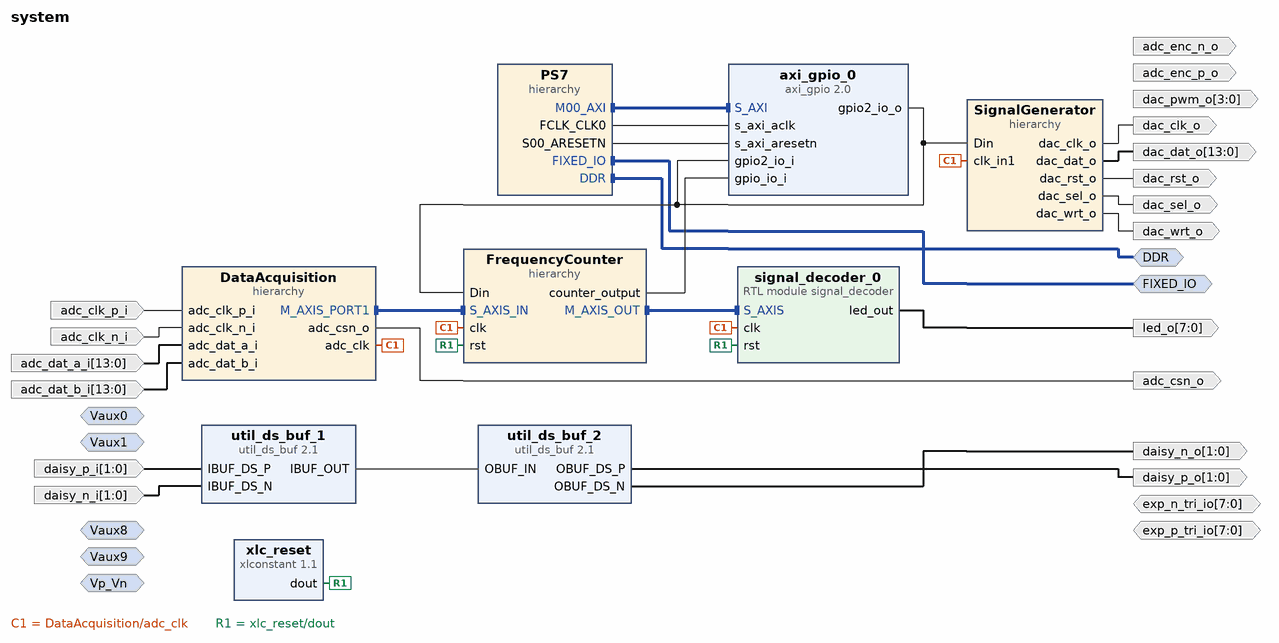
[diagram p0: block diagram of the top level]
# Vivado block design system, xc7z010clg400-1, Vivado 2020.1
create_bd_design system

create_bd_intf_port -mode Slave -vlnv xilinx.com:interface:diff_analog_io_rtl:1.0 Vp_Vn
create_bd_intf_port -mode Slave -vlnv xilinx.com:interface:diff_analog_io_rtl:1.0 Vaux0
create_bd_intf_port -mode Slave -vlnv xilinx.com:interface:diff_analog_io_rtl:1.0 Vaux1
create_bd_intf_port -mode Slave -vlnv xilinx.com:interface:diff_analog_io_rtl:1.0 Vaux9
create_bd_intf_port -mode Slave -vlnv xilinx.com:interface:diff_analog_io_rtl:1.0 Vaux8
create_bd_intf_port -mode Master -vlnv xilinx.com:interface:ddrx_rtl:1.0 DDR
create_bd_intf_port -mode Master -vlnv xilinx.com:display_processing_system7:fixedio_rtl:1.0 FIXED_IO
create_bd_port -dir I -from 13 -to 0 adc_dat_a_i
create_bd_port -dir I -from 13 -to 0 adc_dat_b_i
create_bd_port -dir I adc_clk_p_i
create_bd_port -dir I adc_clk_n_i
create_bd_port -dir O adc_enc_p_o
create_bd_port -dir O adc_enc_n_o
create_bd_port -dir O adc_csn_o
create_bd_port -dir O -from 13 -to 0 dac_dat_o
create_bd_port -dir O dac_clk_o
create_bd_port -dir O dac_rst_o
create_bd_port -dir O dac_sel_o
create_bd_port -dir O dac_wrt_o
create_bd_port -dir O -from 3 -to 0 dac_pwm_o
create_bd_port -dir IO -from 7 -to 0 exp_p_tri_io
create_bd_port -dir IO -from 7 -to 0 exp_n_tri_io
create_bd_port -dir O -from 1 -to 0 daisy_p_o
create_bd_port -dir O -from 1 -to 0 daisy_n_o
create_bd_port -dir I -from 1 -to 0 daisy_p_i
create_bd_port -dir I -from 1 -to 0 daisy_n_i
create_bd_port -dir O -from 7 -to 0 led_o

create_bd_cell -type ip -vlnv xilinx.com:ip:util_ds_buf:2.1 util_ds_buf_1
set_property -dict {CONFIG.C_SIZE 2} [get_bd_cells util_ds_buf_1]
create_bd_cell -type ip -vlnv xilinx.com:ip:util_ds_buf:2.1 util_ds_buf_2
set_property -dict {CONFIG.C_BUF_TYPE OBUFDS CONFIG.C_SIZE 2} [get_bd_cells util_ds_buf_2]
create_bd_cell -type ip -vlnv xilinx.com:ip:axi_gpio:2.0 axi_gpio_0
set_property -dict {CONFIG.C_ALL_INPUTS 1 CONFIG.C_ALL_INPUTS_2 0 CONFIG.C_IS_DUAL 1} [get_bd_cells axi_gpio_0]
create_bd_cell -type ip -vlnv xilinx.com:ip:xlconstant:1.1 xlc_reset
create_bd_cell -type module -reference signal_decoder signal_decoder_0
create_bd_cell -type hier SignalGenerator
create_bd_cell -type hier DataAcquisition
create_bd_cell -type hier FrequencyCounter
create_bd_cell -type hier PS7

# ---- hierarchy /SignalGenerator ----
current_bd_instance /SignalGenerator
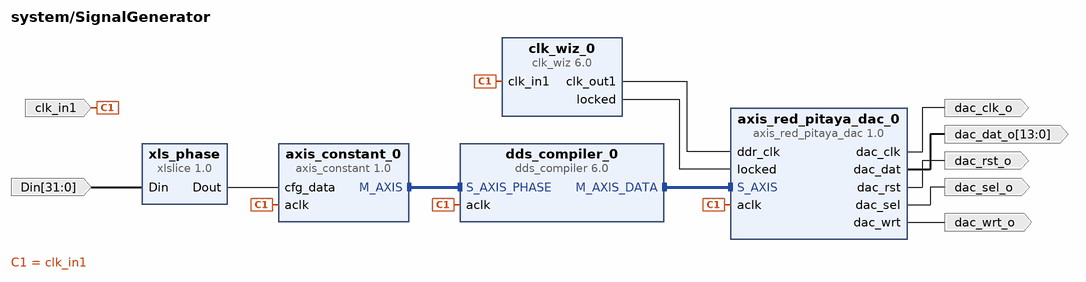
[diagram p1: block diagram inside /SignalGenerator]
create_bd_pin -dir I -type clk clk_in1
create_bd_pin -dir O -type clk dac_clk_o
create_bd_pin -dir O -type rst dac_rst_o
create_bd_pin -dir O dac_sel_o
create_bd_pin -dir O dac_wrt_o
create_bd_pin -dir O -from 13 -to 0 dac_dat_o
create_bd_pin -dir I -from 31 -to 0 Din

create_bd_cell -type ip -vlnv pavel-demin:user:axis_red_pitaya_dac:1.0 axis_red_pitaya_dac_0
create_bd_cell -type ip -vlnv xilinx.com:ip:dds_compiler:6.0 dds_compiler_0
set_property -dict [list \
  CONFIG.Amplitude_Mode Full_Range \
  CONFIG.DATA_Has_TLAST Not_Required \
  CONFIG.DDS_Clock_Rate 125 \
  CONFIG.Frequency_Resolution 0.5 \
  CONFIG.Has_Phase_Out false \
  CONFIG.Latency 8 \
  CONFIG.Latency_Configuration Auto \
  CONFIG.M_DATA_Has_TUSER Not_Required \
  CONFIG.M_PHASE_Has_TUSER Not_Required \
  CONFIG.Noise_Shaping Auto \
  CONFIG.Output_Frequency1 0 \
  CONFIG.Output_Width 14 \
  CONFIG.PINC1 0 \
  CONFIG.Parameter_Entry System_Parameters \
  CONFIG.PartsPresent Phase_Generator_and_SIN_COS_LUT \
  CONFIG.Phase_Increment Streaming \
  CONFIG.Phase_Width 28 \
  CONFIG.Phase_offset None \
  CONFIG.S_PHASE_Has_TUSER Not_Required \
  CONFIG.Spurious_Free_Dynamic_Range 84 \
] [get_bd_cells dds_compiler_0]
create_bd_cell -type ip -vlnv xilinx.com:ip:clk_wiz:6.0 clk_wiz_0
set_property -dict [list \
  CONFIG.CLKIN1_JITTER_PS 80.0 \
  CONFIG.CLKOUT1_JITTER 104.759 \
  CONFIG.CLKOUT1_PHASE_ERROR 96.948 \
  CONFIG.CLKOUT1_REQUESTED_OUT_FREQ 250.000 \
  CONFIG.MMCM_CLKFBOUT_MULT_F 8.000 \
  CONFIG.MMCM_CLKIN1_PERIOD 8.000 \
  CONFIG.MMCM_CLKOUT0_DIVIDE_F 4.000 \
  CONFIG.MMCM_DIVCLK_DIVIDE 1 \
  CONFIG.PRIM_IN_FREQ 125.000 \
  CONFIG.USE_RESET false \
] [get_bd_cells clk_wiz_0]
create_bd_cell -type ip -vlnv pavel-demin:user:axis_constant:1.0 axis_constant_0
create_bd_cell -type ip -vlnv xilinx.com:ip:xlslice:1.0 xls_phase
set_property -dict {CONFIG.DIN_FROM 31 CONFIG.DIN_TO 5} [get_bd_cells xls_phase]

# ---- hierarchy /DataAcquisition ----
current_bd_instance /DataAcquisition
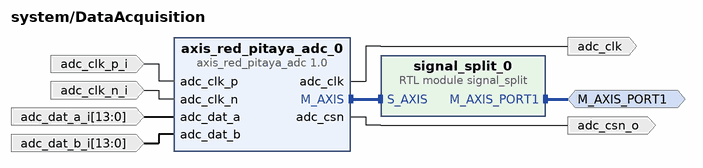
[diagram p2: block diagram inside /DataAcquisition]
create_bd_intf_pin -mode Master -vlnv xilinx.com:interface:axis_rtl:1.0 M_AXIS_PORT1
create_bd_pin -dir O -type clk adc_clk
create_bd_pin -dir O adc_csn_o
create_bd_pin -dir I adc_clk_p_i
create_bd_pin -dir I adc_clk_n_i
create_bd_pin -dir I -from 13 -to 0 adc_dat_a_i
create_bd_pin -dir I -from 13 -to 0 adc_dat_b_i

create_bd_cell -type ip -vlnv pavel-demin:user:axis_red_pitaya_adc:1.0 axis_red_pitaya_adc_0
create_bd_cell -type module -reference signal_split signal_split_0

# ---- hierarchy /FrequencyCounter ----
current_bd_instance /FrequencyCounter
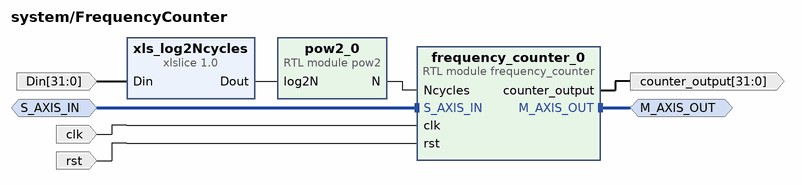
[diagram p3: block diagram inside /FrequencyCounter]
create_bd_intf_pin -mode Master -vlnv xilinx.com:interface:axis_rtl:1.0 M_AXIS_OUT
create_bd_intf_pin -mode Slave -vlnv xilinx.com:interface:axis_rtl:1.0 S_AXIS_IN
create_bd_pin -dir I -from 31 -to 0 Din
create_bd_pin -dir I -type clk clk
create_bd_pin -dir I -type rst rst
create_bd_pin -dir O -from 31 -to 0 counter_output

create_bd_cell -type ip -vlnv xilinx.com:ip:xlslice:1.0 xls_log2Ncycles
set_property -dict {CONFIG.DIN_FROM 4 CONFIG.DIN_TO 0} [get_bd_cells xls_log2Ncycles]
create_bd_cell -type module -reference pow2 pow2_0
create_bd_cell -type module -reference frequency_counter frequency_counter_0

# ---- hierarchy /PS7 ----
current_bd_instance /PS7
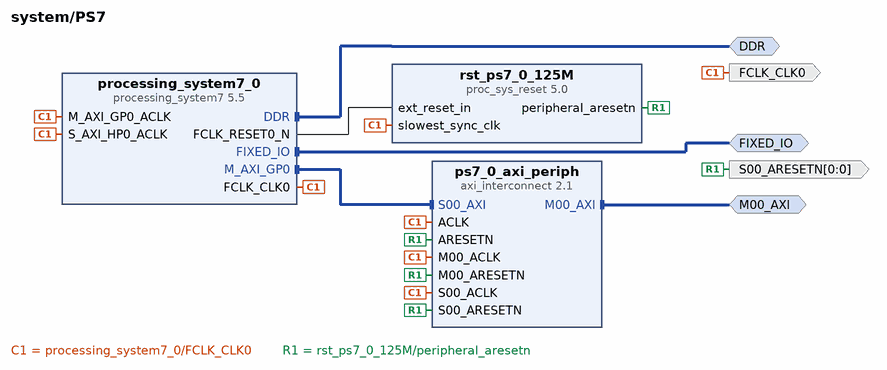
[diagram p4: block diagram inside /PS7]
create_bd_intf_pin -mode Master -vlnv xilinx.com:interface:ddrx_rtl:1.0 DDR
create_bd_intf_pin -mode Master -vlnv xilinx.com:display_processing_system7:fixedio_rtl:1.0 FIXED_IO
create_bd_intf_pin -mode Master -vlnv xilinx.com:interface:aximm_rtl:1.0 M00_AXI
create_bd_pin -dir O -type clk FCLK_CLK0
create_bd_pin -dir O -from 0 -to 0 -type rst S00_ARESETN

create_bd_cell -type ip -vlnv xilinx.com:ip:processing_system7:5.5 processing_system7_0
set_property -dict [list \
  CONFIG.PCW_APU_PERIPHERAL_FREQMHZ 666.666666 \
  CONFIG.PCW_ENET0_ENET0_IO {MIO 16 .. 27} \
  CONFIG.PCW_ENET0_GRP_MDIO_ENABLE 1 \
  CONFIG.PCW_ENET0_GRP_MDIO_IO EMIO \
  CONFIG.PCW_ENET0_PERIPHERAL_ENABLE 1 \
  CONFIG.PCW_ENET0_RESET_ENABLE 0 \
  CONFIG.PCW_ENET_RESET_ENABLE 1 \
  CONFIG.PCW_ENET_RESET_SELECT {Share reset pin} \
  CONFIG.PCW_FPGA0_PERIPHERAL_FREQMHZ 125 \
  CONFIG.PCW_FPGA1_PERIPHERAL_FREQMHZ 250 \
  CONFIG.PCW_FPGA3_PERIPHERAL_FREQMHZ 200 \
  CONFIG.PCW_GPIO_MIO_GPIO_ENABLE 1 \
  CONFIG.PCW_GPIO_MIO_GPIO_IO MIO \
  CONFIG.PCW_GPIO_PERIPHERAL_ENABLE 1 \
  CONFIG.PCW_I2C0_GRP_INT_ENABLE 0 \
  CONFIG.PCW_I2C0_I2C0_IO {MIO 50 .. 51} \
  CONFIG.PCW_I2C0_PERIPHERAL_ENABLE 1 \
  CONFIG.PCW_I2C_PERIPHERAL_FREQMHZ 111.111115 \
  CONFIG.PCW_I2C_RESET_ENABLE 1 \
  CONFIG.PCW_I2C_RESET_SELECT {Share reset pin} \
  CONFIG.PCW_IMPORT_BOARD_PRESET cfg/red_pitaya.xml \
  CONFIG.PCW_PRESET_BANK1_VOLTAGE {LVCMOS 2.5V} \
  CONFIG.PCW_QSPI_GRP_SINGLE_SS_ENABLE 1 \
  CONFIG.PCW_QSPI_GRP_SINGLE_SS_IO {MIO 1 .. 6} \
  CONFIG.PCW_QSPI_PERIPHERAL_ENABLE 1 \
  CONFIG.PCW_QSPI_PERIPHERAL_FREQMHZ 125 \
  CONFIG.PCW_QSPI_QSPI_IO {MIO 1 .. 6} \
  CONFIG.PCW_SD0_GRP_CD_ENABLE 1 \
  CONFIG.PCW_SD0_GRP_CD_IO {MIO 46} \
  CONFIG.PCW_SD0_GRP_WP_ENABLE 1 \
  CONFIG.PCW_SD0_GRP_WP_IO {MIO 47} \
  CONFIG.PCW_SD0_PERIPHERAL_ENABLE 1 \
  CONFIG.PCW_SD0_SD0_IO {MIO 40 .. 45} \
  CONFIG.PCW_SDIO_PERIPHERAL_FREQMHZ 100 \
  CONFIG.PCW_SINGLE_QSPI_DATA_MODE x4 \
  CONFIG.PCW_SPI0_PERIPHERAL_ENABLE 1 \
  CONFIG.PCW_SPI0_SPI0_IO EMIO \
  CONFIG.PCW_SPI1_PERIPHERAL_ENABLE 1 \
  CONFIG.PCW_SPI1_SPI1_IO {MIO 10 .. 15} \
  CONFIG.PCW_TTC0_PERIPHERAL_ENABLE 1 \
  CONFIG.PCW_TTC0_TTC0_IO EMIO \
  CONFIG.PCW_UART0_PERIPHERAL_ENABLE 1 \
  CONFIG.PCW_UART0_UART0_IO {MIO 14 .. 15} \
  CONFIG.PCW_UART1_PERIPHERAL_ENABLE 1 \
  CONFIG.PCW_UART1_UART1_IO {MIO 8 .. 9} \
  CONFIG.PCW_UART_PERIPHERAL_FREQMHZ 100 \
  CONFIG.PCW_UIPARAM_DDR_BUS_WIDTH {16 Bit} \
  CONFIG.PCW_UIPARAM_DDR_FREQ_MHZ 533.333333 \
  CONFIG.PCW_UIPARAM_DDR_PARTNO {MT41J256M16 RE-125} \
  CONFIG.PCW_USB0_PERIPHERAL_ENABLE 1 \
  CONFIG.PCW_USB0_RESET_ENABLE 1 \
  CONFIG.PCW_USB0_RESET_IO {MIO 48} \
  CONFIG.PCW_USB0_USB0_IO {MIO 28 .. 39} \
  CONFIG.PCW_USB_RESET_ENABLE 1 \
  CONFIG.PCW_USB_RESET_SELECT {Share reset pin} \
  CONFIG.PCW_USE_S_AXI_HP0 1 \
] [get_bd_cells processing_system7_0]
# 429 more settings of processing_system7_0 are not shown: defaults, MIO pin electricals, DDR timing, and values the tool derives
create_bd_cell -type ip -vlnv xilinx.com:ip:proc_sys_reset:5.0 rst_ps7_0_125M
create_bd_cell -type ip -vlnv xilinx.com:ip:axi_interconnect:2.1 ps7_0_axi_periph
set_property -dict {CONFIG.NUM_MI 1} [get_bd_cells ps7_0_axi_periph]

# ---- connections ----

current_bd_instance /SignalGenerator
connect_bd_intf_net [get_bd_intf_pins axis_constant_0/M_AXIS] [get_bd_intf_pins dds_compiler_0/S_AXIS_PHASE]
connect_bd_intf_net [get_bd_intf_pins dds_compiler_0/M_AXIS_DATA] [get_bd_intf_pins axis_red_pitaya_dac_0/S_AXIS]
connect_bd_net [get_bd_pins clk_wiz_0/clk_out1] [get_bd_pins axis_red_pitaya_dac_0/ddr_clk]
connect_bd_net [get_bd_pins clk_wiz_0/locked] [get_bd_pins axis_red_pitaya_dac_0/locked]
connect_bd_net [get_bd_pins xls_phase/Dout] [get_bd_pins axis_constant_0/cfg_data]
connect_bd_net -net axis_red_pitaya_adc_0_adc_clk [get_bd_pins clk_in1] \
  [get_bd_pins clk_wiz_0/clk_in1] [get_bd_pins dds_compiler_0/aclk] [get_bd_pins axis_constant_0/aclk] \
  [get_bd_pins axis_red_pitaya_dac_0/aclk]
connect_bd_net [get_bd_pins axis_red_pitaya_dac_0/dac_clk] [get_bd_pins dac_clk_o]
connect_bd_net [get_bd_pins axis_red_pitaya_dac_0/dac_rst] [get_bd_pins dac_rst_o]
connect_bd_net [get_bd_pins axis_red_pitaya_dac_0/dac_sel] [get_bd_pins dac_sel_o]
connect_bd_net [get_bd_pins axis_red_pitaya_dac_0/dac_wrt] [get_bd_pins dac_wrt_o]
connect_bd_net [get_bd_pins axis_red_pitaya_dac_0/dac_dat] [get_bd_pins dac_dat_o]
connect_bd_net -net axi_gpio_0_gpio2_io_o [get_bd_pins Din] [get_bd_pins xls_phase/Din]

current_bd_instance /DataAcquisition
connect_bd_intf_net [get_bd_intf_pins M_AXIS_PORT1] [get_bd_intf_pins signal_split_0/M_AXIS_PORT1]
connect_bd_intf_net [get_bd_intf_pins signal_split_0/S_AXIS] [get_bd_intf_pins axis_red_pitaya_adc_0/M_AXIS]
connect_bd_net [get_bd_pins axis_red_pitaya_adc_0/adc_clk] [get_bd_pins adc_clk]
connect_bd_net [get_bd_pins axis_red_pitaya_adc_0/adc_csn] [get_bd_pins adc_csn_o]
connect_bd_net [get_bd_pins adc_clk_p_i] [get_bd_pins axis_red_pitaya_adc_0/adc_clk_p]
connect_bd_net [get_bd_pins adc_clk_n_i] [get_bd_pins axis_red_pitaya_adc_0/adc_clk_n]
connect_bd_net [get_bd_pins adc_dat_a_i] [get_bd_pins axis_red_pitaya_adc_0/adc_dat_a]
connect_bd_net [get_bd_pins adc_dat_b_i] [get_bd_pins axis_red_pitaya_adc_0/adc_dat_b]

current_bd_instance /FrequencyCounter
connect_bd_intf_net [get_bd_intf_pins M_AXIS_OUT] [get_bd_intf_pins frequency_counter_0/M_AXIS_OUT]
connect_bd_intf_net -intf_net signal_split_0_M_AXIS_PORT1 [get_bd_intf_pins S_AXIS_IN] [get_bd_intf_pins frequency_counter_0/S_AXIS_IN]
connect_bd_net [get_bd_pins xls_log2Ncycles/Dout] [get_bd_pins pow2_0/log2N]
connect_bd_net -net pos2_0_N [get_bd_pins pow2_0/N] [get_bd_pins frequency_counter_0/Ncycles]
connect_bd_net -net axi_gpio_0_gpio2_io_o [get_bd_pins Din] [get_bd_pins xls_log2Ncycles/Din]
connect_bd_net -net axis_red_pitaya_adc_0_adc_clk [get_bd_pins clk] [get_bd_pins frequency_counter_0/clk]
connect_bd_net -net xlc_reset_dout [get_bd_pins rst] [get_bd_pins frequency_counter_0/rst]
connect_bd_net [get_bd_pins frequency_counter_0/counter_output] [get_bd_pins counter_output]

current_bd_instance /PS7
connect_bd_intf_net [get_bd_intf_pins DDR] [get_bd_intf_pins processing_system7_0/DDR]
connect_bd_intf_net [get_bd_intf_pins FIXED_IO] [get_bd_intf_pins processing_system7_0/FIXED_IO]
connect_bd_intf_net [get_bd_intf_pins M00_AXI] [get_bd_intf_pins ps7_0_axi_periph/M00_AXI]
connect_bd_intf_net [get_bd_intf_pins processing_system7_0/M_AXI_GP0] [get_bd_intf_pins ps7_0_axi_periph/S00_AXI]
connect_bd_net [get_bd_pins processing_system7_0/FCLK_RESET0_N] [get_bd_pins rst_ps7_0_125M/ext_reset_in]
connect_bd_net [get_bd_pins processing_system7_0/FCLK_CLK0] \
  [get_bd_pins FCLK_CLK0] [get_bd_pins processing_system7_0/S_AXI_HP0_ACLK] [get_bd_pins ps7_0_axi_periph/S00_ACLK] \
  [get_bd_pins rst_ps7_0_125M/slowest_sync_clk] [get_bd_pins ps7_0_axi_periph/M00_ACLK] [get_bd_pins ps7_0_axi_periph/ACLK] \
  [get_bd_pins processing_system7_0/M_AXI_GP0_ACLK]
connect_bd_net [get_bd_pins rst_ps7_0_125M/peripheral_aresetn] \
  [get_bd_pins S00_ARESETN] [get_bd_pins ps7_0_axi_periph/S00_ARESETN] [get_bd_pins ps7_0_axi_periph/M00_ARESETN] \
  [get_bd_pins ps7_0_axi_periph/ARESETN]

current_bd_instance /
connect_bd_intf_net -intf_net processing_system7_0_FIXED_IO [get_bd_intf_ports FIXED_IO] [get_bd_intf_pins PS7/FIXED_IO]
connect_bd_intf_net -intf_net processing_system7_0_DDR [get_bd_intf_ports DDR] [get_bd_intf_pins PS7/DDR]
connect_bd_intf_net -intf_net signal_split_0_M_AXIS_PORT1 [get_bd_intf_pins FrequencyCounter/S_AXIS_IN] [get_bd_intf_pins DataAcquisition/M_AXIS_PORT1]
connect_bd_intf_net [get_bd_intf_pins PS7/M00_AXI] [get_bd_intf_pins axi_gpio_0/S_AXI]
connect_bd_intf_net -intf_net frequency_counter_0_M_AXIS_OUT [get_bd_intf_pins FrequencyCounter/M_AXIS_OUT] [get_bd_intf_pins signal_decoder_0/S_AXIS]
connect_bd_net [get_bd_ports daisy_p_i] [get_bd_pins util_ds_buf_1/IBUF_DS_P]
connect_bd_net [get_bd_ports daisy_n_i] [get_bd_pins util_ds_buf_1/IBUF_DS_N]
connect_bd_net [get_bd_pins util_ds_buf_2/OBUF_DS_P] [get_bd_ports daisy_p_o]
connect_bd_net [get_bd_pins util_ds_buf_2/OBUF_DS_N] [get_bd_ports daisy_n_o]
connect_bd_net [get_bd_pins util_ds_buf_1/IBUF_OUT] [get_bd_pins util_ds_buf_2/OBUF_IN]
connect_bd_net -net processing_system7_0_FCLK_CLK0 [get_bd_pins PS7/FCLK_CLK0] [get_bd_pins axi_gpio_0/s_axi_aclk]
connect_bd_net [get_bd_ports adc_clk_p_i] [get_bd_pins DataAcquisition/adc_clk_p_i]
connect_bd_net [get_bd_ports adc_clk_n_i] [get_bd_pins DataAcquisition/adc_clk_n_i]
connect_bd_net [get_bd_ports adc_dat_a_i] [get_bd_pins DataAcquisition/adc_dat_a_i]
connect_bd_net [get_bd_ports adc_dat_b_i] [get_bd_pins DataAcquisition/adc_dat_b_i]
connect_bd_net -net axis_red_pitaya_adc_0_adc_csn [get_bd_pins DataAcquisition/adc_csn_o] [get_bd_ports adc_csn_o]
connect_bd_net -net axis_red_pitaya_dac_0_dac_clk [get_bd_pins SignalGenerator/dac_clk_o] [get_bd_ports dac_clk_o]
connect_bd_net -net axis_red_pitaya_dac_0_dac_rst [get_bd_pins SignalGenerator/dac_rst_o] [get_bd_ports dac_rst_o]
connect_bd_net -net axis_red_pitaya_dac_0_dac_sel [get_bd_pins SignalGenerator/dac_sel_o] [get_bd_ports dac_sel_o]
connect_bd_net -net axis_red_pitaya_dac_0_dac_wrt [get_bd_pins SignalGenerator/dac_wrt_o] [get_bd_ports dac_wrt_o]
connect_bd_net -net axis_red_pitaya_dac_0_dac_dat [get_bd_pins SignalGenerator/dac_dat_o] [get_bd_ports dac_dat_o]
connect_bd_net -net axis_red_pitaya_adc_0_adc_clk [get_bd_pins DataAcquisition/adc_clk] \
  [get_bd_pins signal_decoder_0/clk] [get_bd_pins SignalGenerator/clk_in1] [get_bd_pins FrequencyCounter/clk]
connect_bd_net -net rst_ps7_0_125M_peripheral_aresetn [get_bd_pins PS7/S00_ARESETN] [get_bd_pins axi_gpio_0/s_axi_aresetn]
connect_bd_net [get_bd_pins xlc_reset/dout] [get_bd_pins signal_decoder_0/rst] [get_bd_pins FrequencyCounter/rst]
connect_bd_net [get_bd_pins signal_decoder_0/led_out] [get_bd_ports led_o]
connect_bd_net -net frequency_counter_0_counter_output [get_bd_pins FrequencyCounter/counter_output] [get_bd_pins axi_gpio_0/gpio_io_i]
connect_bd_net [get_bd_pins axi_gpio_0/gpio2_io_o] \
  [get_bd_pins axi_gpio_0/gpio2_io_i] [get_bd_pins SignalGenerator/Din] [get_bd_pins FrequencyCounter/Din]

# ---- address map ----
assign_bd_address -offset 0x42000000 -range 4K -target_address_space [get_bd_addr_spaces PS7/processing_system7_0/Data] [get_bd_addr_segs axi_gpio_0/S_AXI/Reg]

validate_bd_design
save_bd_design
